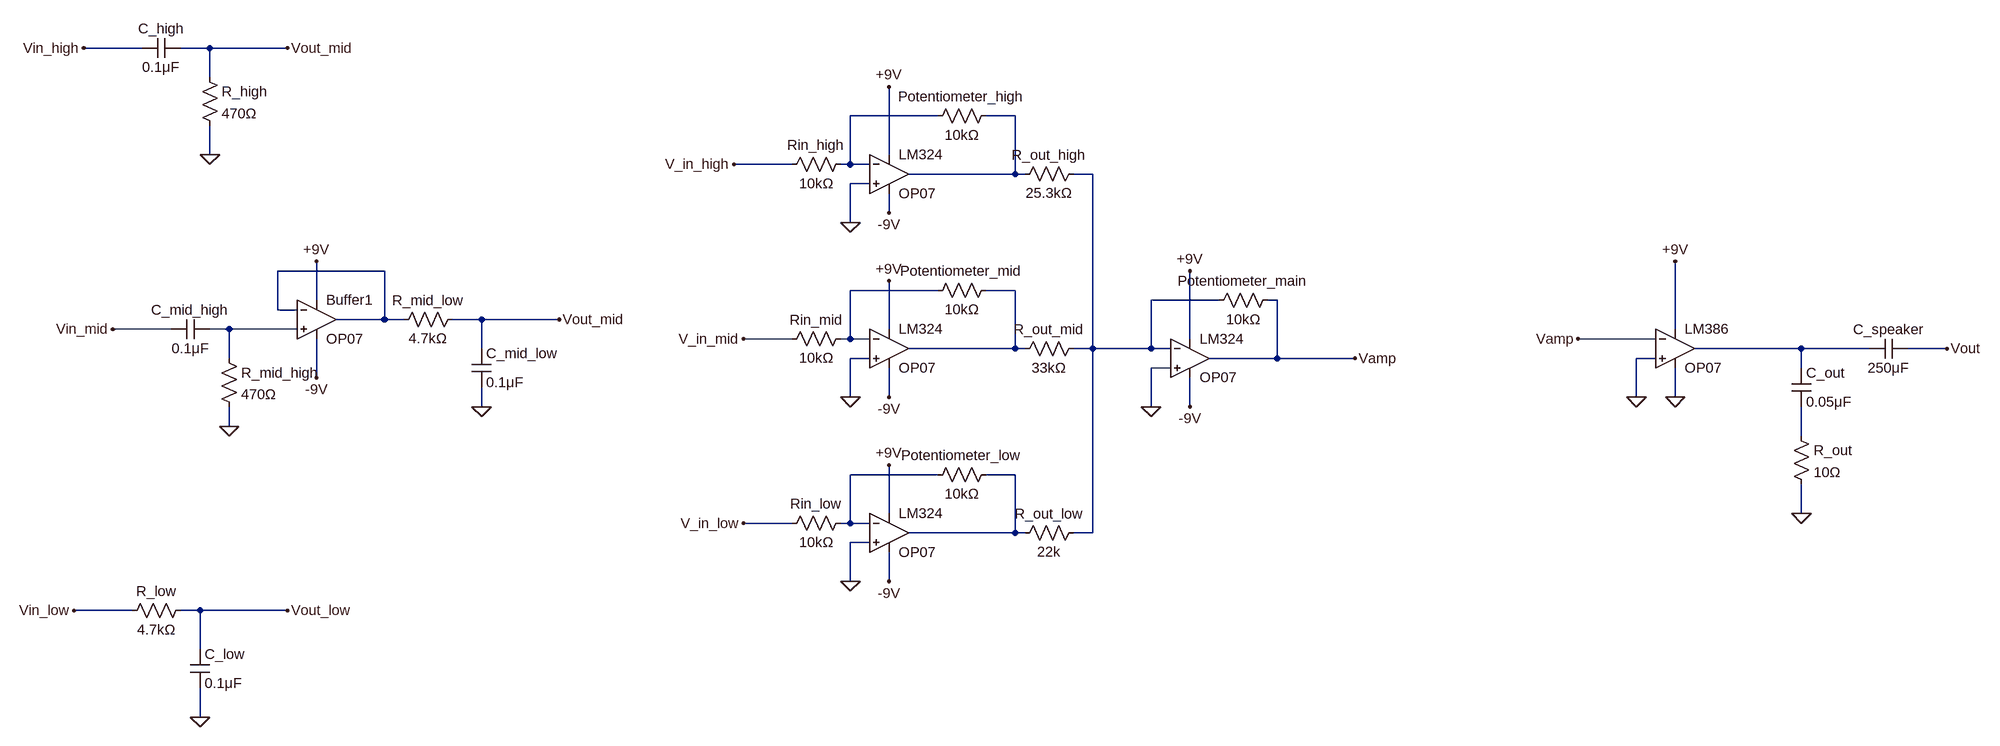
[diagram p0: schematic Audio Equalizer Components Schematic.asc]
Audio Equalizer Components Schematic.asc, the LTspice schematic file:
Version 4.1
SHEET 1 2808 772
WIRE -240 -352 -336 -352
WIRE -128 -352 -176 -352
WIRE 0 -352 -128 -352
WIRE -128 -304 -128 -352
WIRE 1072 -240 928 -240
WIRE 1200 -240 1152 -240
WIRE -128 -176 -128 -224
WIRE 992 -176 992 -288
WIRE 832 -160 736 -160
WIRE 928 -160 928 -240
WIRE 928 -160 912 -160
WIRE 960 -160 928 -160
WIRE 1200 -144 1200 -240
WIRE 1200 -144 1024 -144
WIRE 1216 -144 1200 -144
WIRE 1328 -144 1296 -144
WIRE 960 -128 928 -128
WIRE 992 -80 992 -112
WIRE 928 -64 928 -128
WIRE 160 16 -16 16
WIRE 1072 48 928 48
WIRE 1200 48 1152 48
WIRE 48 64 48 0
WIRE 1536 64 1424 64
WIRE 1632 64 1616 64
WIRE -16 80 -16 16
WIRE 16 80 -16 80
WIRE 160 96 160 16
WIRE 160 96 80 96
WIRE 192 96 160 96
WIRE 320 96 272 96
WIRE 448 96 320 96
WIRE -192 112 -288 112
WIRE -96 112 -128 112
WIRE 16 112 -96 112
WIRE 992 112 992 32
WIRE 2288 112 2288 0
WIRE 832 128 752 128
WIRE 928 128 928 48
WIRE 928 128 912 128
WIRE 960 128 928 128
WIRE 1488 128 1488 16
WIRE 2256 128 2128 128
WIRE 320 144 320 96
WIRE 1200 144 1200 48
WIRE 1200 144 1024 144
WIRE 1216 144 1200 144
WIRE 1328 144 1328 -144
WIRE 1328 144 1296 144
WIRE 1424 144 1424 64
WIRE 1424 144 1328 144
WIRE 1456 144 1424 144
WIRE 2496 144 2320 144
WIRE 2608 144 2496 144
WIRE 2736 144 2672 144
WIRE -96 160 -96 112
WIRE 960 160 928 160
WIRE 1632 160 1632 64
WIRE 1632 160 1520 160
WIRE 1760 160 1632 160
WIRE 2256 160 2224 160
WIRE 1456 176 1424 176
WIRE 2496 176 2496 144
WIRE 48 192 48 128
WIRE 928 224 928 160
WIRE 992 224 992 176
WIRE 2224 224 2224 160
WIRE 2288 224 2288 176
WIRE 320 240 320 208
WIRE 1424 240 1424 176
WIRE 1488 240 1488 192
WIRE -96 272 -96 240
WIRE 2496 288 2496 240
WIRE 1072 352 928 352
WIRE 1200 352 1152 352
WIRE 992 416 992 336
WIRE 2496 416 2496 368
WIRE 832 432 752 432
WIRE 928 432 928 352
WIRE 928 432 912 432
WIRE 960 432 928 432
WIRE 1200 448 1200 352
WIRE 1200 448 1024 448
WIRE 1216 448 1200 448
WIRE 1328 448 1328 144
WIRE 1328 448 1296 448
WIRE 960 464 928 464
WIRE 928 528 928 464
WIRE 992 528 992 480
WIRE -256 576 -352 576
WIRE -144 576 -176 576
WIRE 0 576 -144 576
WIRE -144 640 -144 576
WIRE -144 752 -144 704
FLAG -128 -176 0
FLAG 928 -64 0
FLAG -96 272 0
FLAG 48 0 +9V
FLAG 48 192 -9V
FLAG 320 240 0
FLAG -144 752 0
FLAG 992 -80 -9V
FLAG 992 -288 +9V
FLAG 928 224 0
FLAG 992 224 -9V
FLAG 992 32 +9V
FLAG 928 528 0
FLAG 992 528 -9V
FLAG 992 336 +9V
FLAG 1424 240 0
FLAG 1488 240 -9V
FLAG 1488 16 +9V
FLAG 2224 224 0
FLAG 2288 0 +9V
FLAG 2288 224 0
FLAG 2496 416 0
FLAG 2736 144 Vout
FLAG -336 -352 Vin_high
FLAG -288 112 Vin_mid
FLAG -352 576 Vin_low
FLAG 0 576 Vout_low
FLAG 448 96 Vout_mid
FLAG 0 -352 Vout_mid
FLAG 1760 160 Vamp
FLAG 736 -160 V_in_high
FLAG 752 128 V_in_mid
FLAG 752 432 V_in_low
FLAG 2128 128 Vamp
SYMBOL res -144 -320 R0
SYMATTR InstName R_high
SYMATTR Value 470Ω
SYMBOL cap -176 -368 R90
WINDOW 0 0 32 VBottom 2
WINDOW 3 32 32 VTop 2
SYMATTR InstName C_high
SYMATTR Value 0.1μF
SYMBOL res 928 -176 R90
WINDOW 0 0 56 VBottom 2
WINDOW 3 32 56 VTop 2
SYMATTR InstName Rin_high
SYMATTR Value 10kΩ
SYMBOL OpAmps\\OP07 992 -208 R0
SYMATTR InstName LM324
SYMBOL res 1168 -256 R90
WINDOW 0 0 56 VBottom 2
WINDOW 3 32 56 VTop 2
SYMATTR InstName Potentiometer_high
SYMATTR Value 10kΩ
SYMBOL cap -128 96 R90
WINDOW 0 0 32 VBottom 2
WINDOW 3 32 32 VTop 2
SYMATTR InstName C_mid_high
SYMATTR Value 0.1μF
SYMBOL res -112 144 R0
SYMATTR InstName R_mid_high
SYMATTR Value 470Ω
SYMBOL OpAmps\\OP07 48 32 R0
SYMATTR InstName Buffer1
SYMBOL res 288 80 R90
WINDOW 0 0 56 VBottom 2
WINDOW 3 32 56 VTop 2
SYMATTR InstName R_mid_low
SYMATTR Value 4.7kΩ
SYMBOL cap 304 144 R0
SYMATTR InstName C_mid_low
SYMATTR Value 0.1μF
SYMBOL res -160 560 R90
WINDOW 0 0 56 VBottom 2
WINDOW 3 32 56 VTop 2
SYMATTR InstName R_low
SYMATTR Value 4.7kΩ
SYMBOL cap -160 640 R0
SYMATTR InstName C_low
SYMATTR Value 0.1μF
SYMBOL res 928 112 R90
WINDOW 0 0 56 VBottom 2
WINDOW 3 32 56 VTop 2
SYMATTR InstName Rin_mid
SYMATTR Value 10kΩ
SYMBOL OpAmps\\OP07 992 80 R0
SYMATTR InstName LM324
SYMBOL res 1168 32 R90
WINDOW 0 0 56 VBottom 2
WINDOW 3 32 56 VTop 2
SYMATTR InstName Potentiometer_mid
SYMATTR Value 10kΩ
SYMBOL res 928 416 R90
WINDOW 0 0 56 VBottom 2
WINDOW 3 32 56 VTop 2
SYMATTR InstName Rin_low
SYMATTR Value 10kΩ
SYMBOL OpAmps\\OP07 992 384 R0
SYMATTR InstName LM324
SYMBOL res 1168 336 R90
WINDOW 0 0 56 VBottom 2
WINDOW 3 32 56 VTop 2
SYMATTR InstName Potentiometer_low
SYMATTR Value 10kΩ
SYMBOL OpAmps\\OP07 1488 96 R0
SYMATTR InstName LM324
SYMBOL res 1632 48 R90
WINDOW 0 0 56 VBottom 2
WINDOW 3 32 56 VTop 2
SYMATTR InstName Potentiometer_main
SYMATTR Value 10kΩ
SYMBOL OpAmps\\OP07 2288 80 R0
SYMATTR InstName LM386
SYMBOL cap 2480 176 R0
SYMATTR InstName C_out
SYMATTR Value 0.05μF
SYMBOL res 2480 272 R0
SYMATTR InstName R_out
SYMATTR Value 10Ω
SYMBOL cap 2672 128 R90
WINDOW 0 0 32 VBottom 2
WINDOW 3 32 32 VTop 2
SYMATTR InstName C_speaker
SYMATTR Value 250μF
SYMBOL res 1312 -160 R90
WINDOW 0 0 56 VBottom 2
WINDOW 3 32 56 VTop 2
SYMATTR InstName R_out_high
SYMATTR Value 25.3kΩ
SYMBOL res 1312 128 R90
WINDOW 0 0 56 VBottom 2
WINDOW 3 32 56 VTop 2
SYMATTR InstName R_out_mid
SYMATTR Value 33kΩ
SYMBOL res 1312 432 R90
WINDOW 0 0 56 VBottom 2
WINDOW 3 32 56 VTop 2
SYMATTR InstName R_out_low
SYMATTR Value 22k

The netlist it stands for:
* Audio Equalizer Components Schematic.asc
R_high Vout_mid 0 470Ω
C_high Vout_mid Vin_high 0.1μF
Rin_high N001 V_in_high 10kΩ
X§LM324 0 N001 +9V -9V N002 LT1001  ; OP07, pins In+ In- V+ V- OUT
R§Potentiometer_high N002 N001 10kΩ
C_mid_high N007 Vin_mid 0.1μF
R_mid_high N007 0 470Ω
X§Buffer1 N007 N004 +9V -9V N004 LT1001  ; OP07, pins In+ In- V+ V- OUT
R_mid_low Vout_mid N004 4.7kΩ
C_mid_low Vout_mid 0 0.1μF
R_low Vout_low Vin_low 4.7kΩ
C_low Vout_low 0 0.1μF
Rin_mid N005 V_in_mid 10kΩ
X§LM324 0 N005 +9V -9V N006 LT1001  ; OP07, pins In+ In- V+ V- OUT
R§Potentiometer_mid N006 N005 10kΩ
Rin_low N010 V_in_low 10kΩ
X§LM324 0 N010 +9V -9V N011 LT1001  ; OP07, pins In+ In- V+ V- OUT
R§Potentiometer_low N011 N010 10kΩ
X§LM324 0 N003 +9V -9V Vamp LT1001  ; OP07, pins In+ In- V+ V- OUT
R§Potentiometer_main Vamp N003 10kΩ
X§LM386 0 Vamp +9V 0 N008 LT1001  ; OP07, pins In+ In- V+ V- OUT
C_out N008 N009 0.05μF
R_out N009 0 10Ω
C_speaker Vout N008 250μF
R_out_high N003 N002 25.3kΩ
R_out_mid N003 N006 33kΩ
R_out_low N003 N011 22k
.lib LTC.lib
.backanno
.end